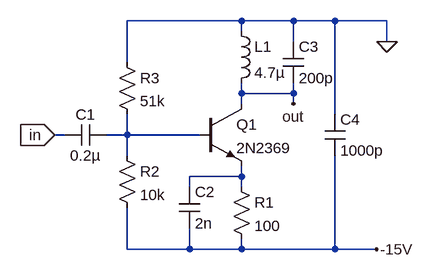
[diagram p0: schematic activeCircuit.asc]
activeCircuit.asc, the LTspice schematic file:
Version 4
SHEET 1 880 680
WIRE 304 -48 128 -48
WIRE 384 -48 304 -48
WIRE 448 -48 384 -48
WIRE 528 -48 448 -48
WIRE 304 -32 304 -48
WIRE 384 -16 384 -48
WIRE 528 -16 528 -48
WIRE 128 16 128 -48
WIRE 304 64 304 48
WIRE 384 64 384 48
WIRE 384 64 304 64
WIRE 304 80 304 64
WIRE 384 80 384 64
WIRE 448 96 448 -48
WIRE 32 128 16 128
WIRE 128 128 128 96
WIRE 128 128 96 128
WIRE 240 128 128 128
WIRE 128 160 128 128
WIRE 304 192 304 176
WIRE 304 192 224 192
WIRE 224 208 224 192
WIRE 304 208 304 192
WIRE 128 304 128 240
WIRE 224 304 224 272
WIRE 224 304 128 304
WIRE 304 304 304 288
WIRE 304 304 224 304
WIRE 448 304 448 160
WIRE 448 304 304 304
WIRE 512 304 448 304
FLAG 528 -16 0
FLAG 16 128 in
IOPIN 16 128 In
FLAG 384 80 out
FLAG 512 304 -15V
SYMBOL cap 32 144 R270
WINDOW 0 32 32 VTop 2
WINDOW 3 0 32 VBottom 2
SYMATTR InstName C1
SYMATTR Value 0.2µ
SYMBOL cap 208 208 R0
SYMATTR InstName C2
SYMATTR Value 2n
SYMBOL cap 368 -16 R0
SYMATTR InstName C3
SYMATTR Value 200p
SYMBOL cap 432 96 R0
SYMATTR InstName C4
SYMATTR Value 1000p
SYMBOL res 288 192 R0
SYMATTR InstName R1
SYMATTR Value 100
SYMBOL res 112 144 R0
SYMATTR InstName R2
SYMATTR Value 10k
SYMBOL res 112 0 R0
SYMATTR InstName R3
SYMATTR Value 51k
SYMBOL npn 240 80 R0
SYMATTR InstName Q1
SYMATTR Value 2N2369
SYMBOL ind 288 -48 R0
SYMATTR InstName L1
SYMATTR Value 4.7µ

The netlist it stands for:
* activeCircuit.asc
C1 in N001 0.2µ
C2 N002 -15V 2n
C3 0 out 200p
C4 0 -15V 1000p
R1 N002 -15V 100
R2 N001 -15V 10k
R3 0 N001 51k
Q1 out N001 N002 0 2N2369
L1 0 out 4.7µ
.model NPN NPN
.model PNP PNP
.lib standard.bjt
.backanno
.end